# Altium schematic sheet LT3042_15V.SchDoc
size A4; SheetNumber: 6; SheetTotal: 27
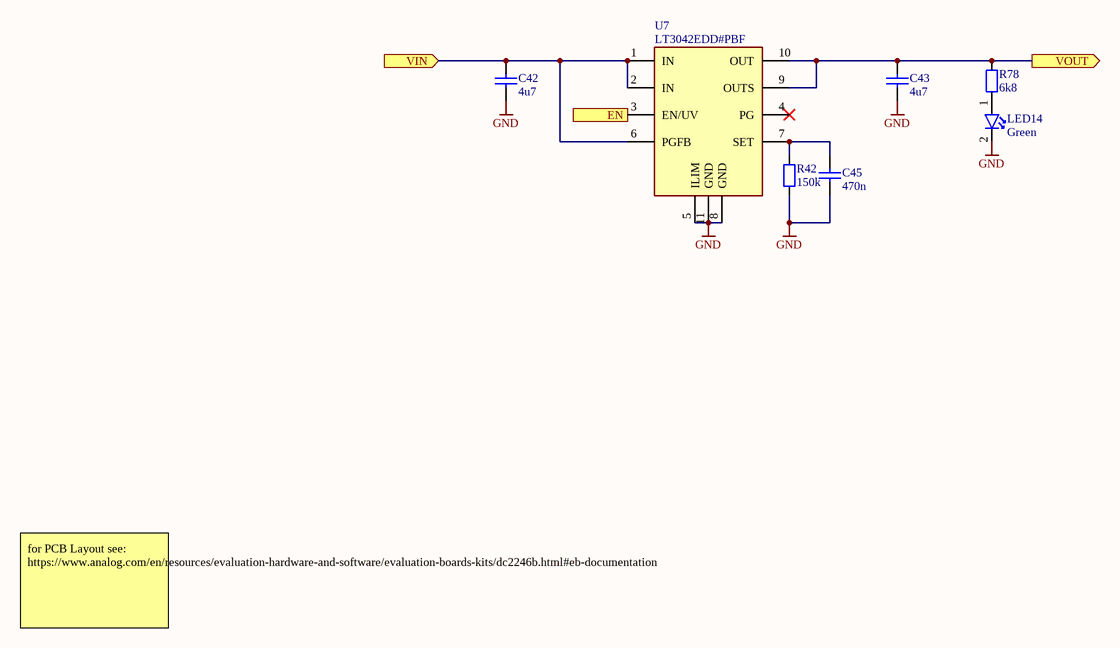
[diagram p0: LT3042_15V.SchDoc]

## Parts
C42  4u7  [C_1206_3216Metric_IPC_N]
C43  4u7  [C_1206_3216Metric_IPC_N]
C45  470n  [C_0402_1005Metric_IPC_N]
LED14  Green  [LED_0603_1806Metric_IPC_N]
R42  150k  [R_0402_1005Metric_IPC_N]
R78  6k8  [R_0402_1005Metric_IPC_N]
U7  LT3042EDD#PBF  [DFN10_3x3]

## Ports
EN (in, see Power_Supply[5A]), VIN (in, see Power_Supply[5A]), VOUT (out, see Power_Supply[6A])

## Nets
GND: C42.1 C43.1 C45.1 LED14.2 R42.1 U7.5(ILIM) U7.8(GND) U7.11(GND)
EN: U7.3(EN/UV) ; port EN
VIN: C42.2 U7.1(IN) U7.2(IN) U7.6(PGFB) ; port VIN
VOUT: C43.2 R78.1 U7.9(OUTS) U7.10(OUT) ; port VOUT
NetC45_2: C45.2 R42.2 U7.7(SET)
NetLED14_1: LED14.1 R78.2

Not connected (* = marked no-connect by the designer): U7 4(PG)*

## Notes on the sheet
- for PCB Layout see:
  https://www.analog.com/en/resources/evaluation-hardware-and-software/evaluation-boards-kits/dc2246b.html#eb-documentation

## Library data of the parts
C42 C43 = C000005: Generic MLCC with 1206 Footprint; Specific Component: False; Temp Coefficient: X7R; Voltage Rated: 15V; ID: C000005; Capacitance: 4u7; Tolerance: *; min Temperature: *; max Temperature: *; Case: 1206
C45 = C000002: Generic MLCC with 0402 Footprint; Specific Component: False; Temp Coefficient: X7R; ID: C000002; Capacitance: 470n; Tolerance: *; Voltage Rated: *; min Temperature: *; max Temperature: *; Case: 0402
LED14 = LED000007: MLCC, Low Current, Green, 2.2V, 20mA, 0603; Manufacturer: Broadcom / Avago; Manufacturer Part Number: HSMG-C190; Specific Component: True; ID: LED000007; Type: Low Current; Colour: Green; Forward Voltage: 2.2V; Current: 20mA; Case: 0603; ComponentLink1Description: Datasheet; ComponentLink1URL: https://www.mouser.de/datasheet/3/57/1/AV02_0551EN_DS_HSMx_Cxxx_25Mar2022.pdf; Supplier 1: Mouser; Supplier Part Number 1: 630-HSMG-C190; Supplier 2: Digikey; Supplier Part Number 2: 516-1425-1-ND
R42 R78 = R000002: Generic Chip Resistor with 0402 Footprint; Specific Component: False; ID: R000002; Tolerance: *; Power Rating: *; Composition: *; min Temperature: *; max Temperature: *; Temp Coefficient: *; Case: 0402
  R42: Resistance: 150k
  R78: Resistance: 6k8
U7 = PMIC000029: Manufacturer: Analog Devices; ID: PMIC000029; Type: LDO; Manufacturer Part Number: LT3042EDD#PBF; Part Value: LT3042EDD#PBF; Case: 10-DFN (3x3); ComponentLink1Description: Datasheet; ComponentLink1URL: https://www.analog.com/media/en/technical-documentation/data-sheets/lt3042.pdf; Supplier 1: Digikey; Supplier Part Number 1: 505-LT3042EDD#PBF-ND; Supplier 2: Mouser; Supplier Part Number 2: 584-LT3042EDD#PBF